# EAGLE design ramanSpectrometer_electronic_controlBoard_5050 (EAGLE 6.2)
meridianScientific DIY 3dPrintable_raspberryPi_ramanSpectrometer controlBoard_01_rev-01
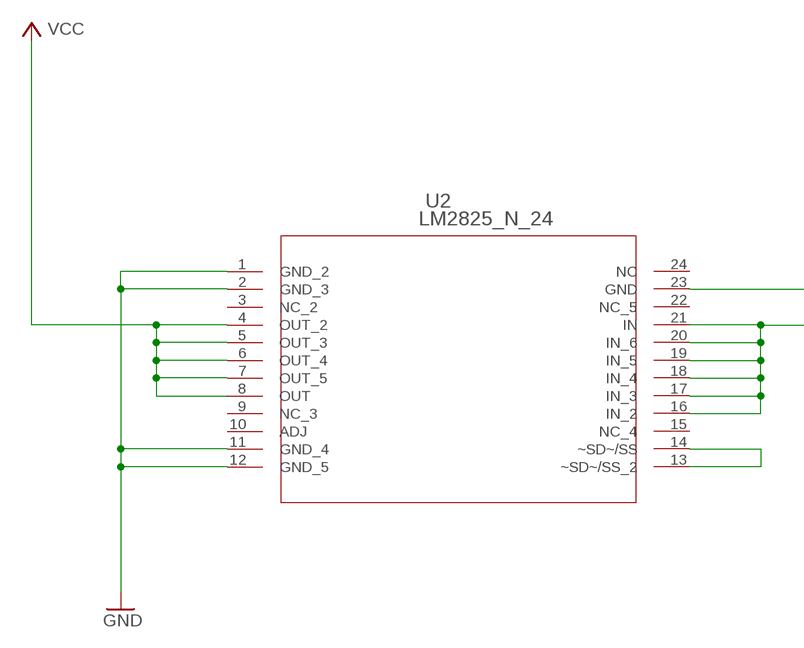
[diagram p0: schematic, sheet 1, part 1 of 2]
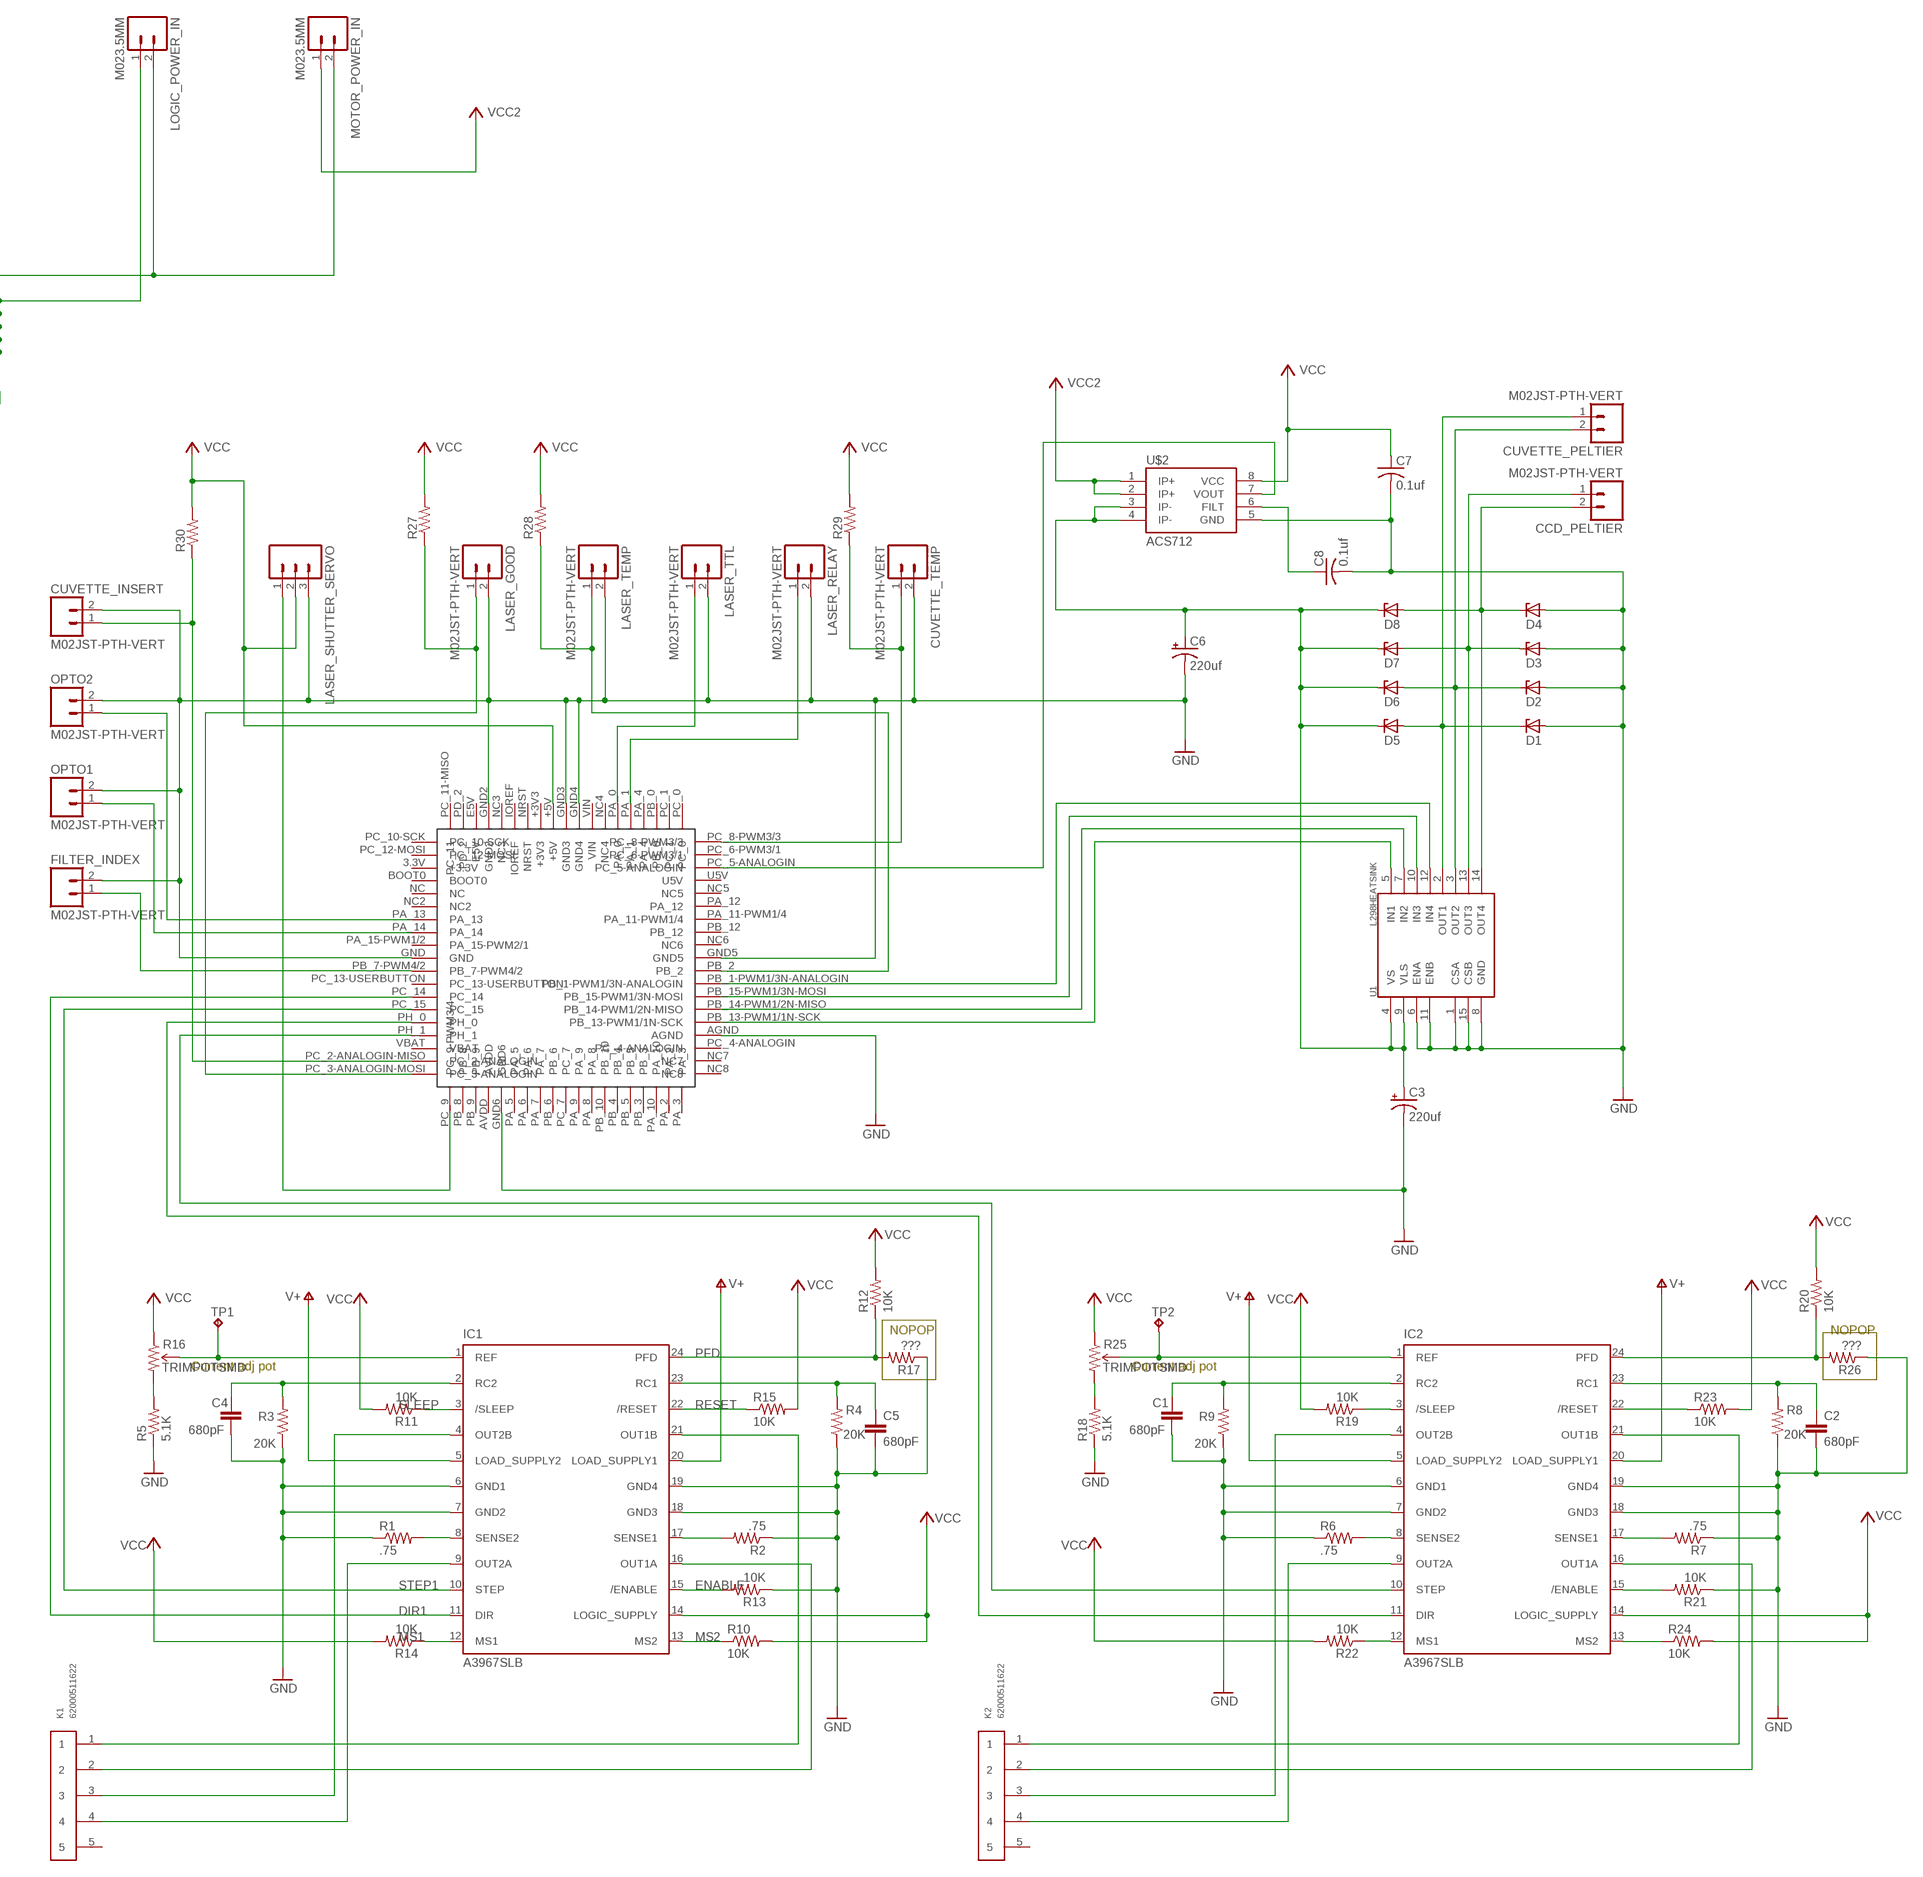
[diagram p1: schematic, sheet 1, part 2 of 2]

## Parts
C1  680pF  CAP0402  [C0402]
C2  680pF  CAP0402  [C0402]
C3  220uf  CAP_POLD  [PANASONIC_D]
C4  680pF  CAP0402  [C0402]
C5  680pF  CAP0402  [C0402]
C6  220uf  CAP_POLD  [PANASONIC_D]
C7  0.1uf  C-USC1206  [C1206]
C8  0.1uf  C-USC1206  [C1206]
CCD_PELTIER  M02JST-PTH-VERT  [JST-2-PTH-VERT]
CUVETTE_INSERT  M02JST-PTH-VERT  [JST-2-PTH-VERT]
CUVETTE_PELTIER  M02JST-PTH-VERT  [JST-2-PTH-VERT]
CUVETTE_TEMP  M02JST-PTH-VERT  [JST-2-PTH-VERT]
D1  ZENER-DIODESMB  [SMB]
D2  ZENER-DIODESMB  [SMB]
D3  ZENER-DIODESMB  [SMB]
D4  ZENER-DIODESMB  [SMB]
D5  ZENER-DIODESMB  [SMB]
D6  ZENER-DIODESMB  [SMB]
D7  ZENER-DIODESMB  [SMB]
D8  ZENER-DIODESMB  [SMB]
FILTER_INDEX  M02JST-PTH-VERT  [JST-2-PTH-VERT]
IC1  A3967SLB  [SO24W]
IC2  A3967SLB  [SO24W]
K1  62000511622  [62000511622]
K2  62000511622  [62000511622]
LASER_GOOD  M02JST-PTH-VERT  [JST-2-PTH-VERT]
LASER_RELAY  M02JST-PTH-VERT  [JST-2-PTH-VERT]
LASER_SHUTTER_SERVO  M03PTH  [1X03]
LASER_TEMP  M02JST-PTH-VERT  [JST-2-PTH-VERT]
LASER_TTL  M02JST-PTH-VERT  [JST-2-PTH-VERT]
LOGIC_POWER_IN  M023.5MM  [SCREWTERMINAL-3.5MM-2]
MOTOR_POWER_IN  M023.5MM  [SCREWTERMINAL-3.5MM-2]
OPTO1  M02JST-PTH-VERT  [JST-2-PTH-VERT]
OPTO2  M02JST-PTH-VERT  [JST-2-PTH-VERT]
R1  .75  R-US_R0805  [R0805]
R2  .75  R-US_R0805  [R0805]
R3  20K  RESISTOR0402  [C0402]
R4  20K  RESISTOR0402  [C0402]
R5  5.1K  RESISTOR0402  [C0402]
R6  .75  R-US_R0805  [R0805]
R7  .75  R-US_R0805  [R0805]
R8  20K  RESISTOR0402  [C0402]
R9  20K  RESISTOR0402  [C0402]
R10  10K  RESISTOR0402  [C0402]
R11  10K  RESISTOR0402  [C0402]
R12  10K  RESISTOR0402  [C0402]
R13  10K  RESISTOR0402  [C0402]
R14  10K  RESISTOR0402  [C0402]
R15  10K  RESISTOR0402  [C0402]
R16  TRIMPOTSMD  [TRIMPOT-3MM]
R17  ???  RESISTOR0402  [C0402]
R18  5.1K  RESISTOR0402  [C0402]
R19  10K  RESISTOR0402  [C0402]
R20  10K  RESISTOR0402  [C0402]
R21  10K  RESISTOR0402  [C0402]
R22  10K  RESISTOR0402  [C0402]
R23  10K  RESISTOR0402  [C0402]
R24  10K  RESISTOR0402  [C0402]
R25  TRIMPOTSMD  [TRIMPOT-3MM]
R26  ???  RESISTOR0402  [C0402]
R27  R-US_M1206  [M1206]
R28  R-US_M1206  [M1206]
R29  R-US_M1206  [M1206]
R30  R-US_M1206  [M1206]
TP1  TPPAD1-13  [P1-13]
TP2  TPPAD1-13  [P1-13]
U1  L298HEATSINK  [MULTIWATT15_6400BGHEATSINK]
U2  LM2825_N_24  [NA24F]
U$1  STNUCLEOF401RE  [F401-RE]
U$2  ACS712  [SO08]

## Nets
+5V: C7.1 IC1.14(LOGIC_SUPPLY) IC2.14(LOGIC_SUPPLY) LASER_SHUTTER_SERVO.2 MOTOR_POWER_IN.1 R10.2 R11.2 R19.2 R20.2 R22.2 R23.2 R24.2 R25.1(CCW) R27.2 R28.2 R29.2 R30.2 U2.4(OUT_2) U2.5(OUT_3) U2.6(OUT_4) U2.7(OUT_5) U2.8(OUT) U$1.+5V U$2.8(VCC) ; supply symbol labelled VCC, VCC2
DIR1: IC1.11(DIR) U$1.PC_14
DIR2: IC2.11(DIR) U$1.PH_0
ENABLE: IC1.15(/ENABLE) R13.2
GND: C1.2 C2.2 C3.- C4.2 C5.2 C6.- C7.2 C8.2 CUVETTE_INSERT.2 CUVETTE_TEMP.2 D1.A D2.A D3.A D4.A FILTER_INDEX.2 IC1.6(GND1) IC1.7(GND2) IC1.18(GND3) IC1.19(GND4) IC2.6(GND1) IC2.7(GND2) IC2.18(GND3) IC2.19(GND4) LASER_GOOD.2 LASER_RELAY.2 LASER_SHUTTER_SERVO.3 LASER_TEMP.2 LASER_TTL.2 OPTO1.2 OPTO2.2 R1.1 R2.1 R3.1 R4.1 R5.1 R6.1 R7.1 R8.1 R9.1 R13.1 R17.1 R18.1 R21.1 R26.1 U1.1(CSA) U1.6(ENA) U1.8(GND) U1.11(ENB) U1.15(CSB) U2.1(GND_2) U2.2(GND_3) U2.11(GND_4) U2.12(GND_5) U$1.AGND U$1.GND U$1.GND2 U$1.GND3 U$1.GND4 U$1.GND5 U$1.GND6 U$2.5(GND)
MS1: IC1.12(MS1) R14.1
MS2: IC1.13(MS2) R10.1
N$1: IC1.8(SENSE2) R1.2
N$2: IC2.24(PFD) R20.1 R26.2
N$3: IC1.17(SENSE1) R2.2
N$4: C2.1 IC2.23(RC1) R8.2
N$5: C4.1 IC1.2(RC2) R3.2
N$6: IC2.22(/RESET) R23.1
N$7: C5.1 IC1.23(RC1) R4.2
N$8: IC2.3(/SLEEP) R19.1
N$9: IC2.17(SENSE1) R7.2
N$10: R18.2 R25.3(CW)
N$11: R5.2 R16.3(CW)
N$12: IC1.1(REF) R16.2(WIPER) TP1.1(TP)
N$13: CUVETTE_PELTIER.1 D1.C D5.A U1.2(OUT1)
N$14: CUVETTE_PELTIER.2 D2.C D6.A U1.3(OUT2)
N$15: CCD_PELTIER.1 D3.C D7.A U1.13(OUT3)
N$16: CCD_PELTIER.2 D4.C D8.A U1.14(OUT4)
N$17: U1.5(IN1) U$1.PB_13-PWM1/1N-SCK
N$18: U1.7(IN2) U$1.PB_14-PWM1/2N-MISO
N$19: U1.10(IN3) U$1.PB_15-PWM1/3N-MOSI
N$20: U1.12(IN4) U$1.PB_1-PWM1/3N-ANALOGIN
N$21: C3.+ C6.+ D5.C D6.C D7.C D8.C U1.4(VS) U1.9(VLS) U$2.3(IP-) U$2.4(IP-)
N$22: U$2.1(IP+) U$2.2(IP+) ; supply symbol labelled VCC2
N$23: C8.1 U$2.6(FILT)
N$24: U$1.PC_5-ANALOGIN U$2.7(VOUT)
N$25: CUVETTE_TEMP.1 R29.1 U$1.PC_8-PWM3/3
N$26: LASER_RELAY.1 U$1.PA_1
N$27: LASER_TTL.1 U$1.PA_0
N$28: LASER_TEMP.1 R28.1 U$1.PB_2
N$29: LASER_GOOD.1 R27.1 U$1.PC_3-ANALOGIN-MOSI(PC_3-ANALOGIN)
N$30: CUVETTE_INSERT.1 R30.1 U$1.PC_2-ANALOGIN-MISO(PC_2-ANALOGIN)
N$31: OPTO2.1 U$1.PA_13
N$32: OPTO1.1 U$1.PA_14
N$33: LOGIC_POWER_IN.2 MOTOR_POWER_IN.2 U2.23(GND)
N$34: IC2.15(/ENABLE) R21.2
N$35: LASER_SHUTTER_SERVO.1 U$1.PC_9(PC_9-PWM3/4)
N$36: U2.13(~SD~/SS_2) U2.14(~SD~/SS)
N$37: LOGIC_POWER_IN.1 U2.16(IN_2) U2.17(IN_3) U2.18(IN_4) U2.19(IN_5) U2.20(IN_6) U2.21(IN)
N$38: IC2.13(MS2) R24.1
N$39: IC2.1(REF) R25.2(WIPER) TP2.1(TP)
N$40: IC2.12(MS1) R22.1
N$41: IC2.8(SENSE2) R6.2
N$42: C1.1 IC2.2(RC2) R9.2
N$43: IC2.9(OUT2A) K2.4
N$44: IC2.4(OUT2B) K2.3
N$45: IC1.4(OUT2B) K1.3
N$46: IC1.9(OUT2A) K1.4
N$47: IC1.16(OUT1A) K1.2
N$48: IC1.21(OUT1B) K1.1
N$49: FILTER_INDEX.1 U$1.PB_7-PWM4/2
OUT1A: IC2.16(OUT1A) K2.2
OUT1B: IC2.21(OUT1B) K2.1
PFD: IC1.24(PFD) R12.1 R17.2
RESET: IC1.22(/RESET) R15.1
SLEEP: IC1.3(/SLEEP) R11.1
STEP1: IC1.10(STEP) U$1.PC_15
STEP2: IC2.10(STEP) U$1.PH_1
V+: IC1.5(LOAD_SUPPLY2) IC1.20(LOAD_SUPPLY1) IC2.5(LOAD_SUPPLY2) IC2.20(LOAD_SUPPLY1)
VCC: R12.2 R14.2 R15.2 R16.1(CCW)
Unconnected: K1.5 K2.5 U2.3(NC_2) U2.9(NC_3) U2.10(ADJ) U2.15(NC_4) U2.22(NC_5) U2.24(NC) U$1.+3V3 U$1.BOOT0 U$1.IOREF U$1.NC U$1.NC2 U$1.NC3 U$1.NC4 U$1.NC5 U$1.NC7 U$1.NC8 U$1.NRST U$1.PA_2 U$1.PA_3 U$1.PA_4 U$1.PA_5 U$1.PA_6 U$1.PA_7 U$1.PA_8 U$1.PA_9 U$1.PA_10 U$1.PA_11-PWM1/4 U$1.PA_12 U$1.PA_15-PWM1/2(PA_15-PWM2/1) U$1.PB_0 U$1.PB_3 U$1.PB_4 U$1.PB_5 U$1.PB_6 U$1.PB_8 U$1.PB_9 U$1.PB_10 U$1.PB_12 U$1.PC_0 U$1.PC_1 U$1.PC_4-ANALOGIN U$1.PC_6-PWM3/1 U$1.PC_7 U$1.PC_10-SCK U$1.PC_11-MISO(PC_11) U$1.PC_12-MOSI U$1.PC_13-USERBUTTON U$1.PD_2 U$1.U5V U$1.VIN

## Notes on the sheet
- NOPOP | NOPOP
- Current adj pot | Current adj pot

## Power pins joined to a net without a drawn wire
+3.3V: U$1.3.3V(+3.3V)
AVDD: U$1.AVDD
E5V: U$1.E5V
NC6: U$1.NC6
VBAT: U$1.VBAT

## Library data of the parts
C1 C2 C4 C5 = SparkFun03_30_09:CAP: Capacitor Standard 0603 ceramic capacitor, and 0.1" leaded capacitor.
C3 C6 = SparkFun-Capacitors:CAP_POL: Capacitor Polarized These are standard SMD and PTH capacitors. Normally 10uF, 47uF, and 100uF in electrolytic and tantalum varieties. Always verify the external diameter of the through hole cap, it varies with capacity, voltage, and manufacturer. The EIA devices should be standard.
C7 C8 = adafruit:C-US: CAPACITOR, American symbol
CCD_PELTIER CUVETTE_INSERT CUVETTE_PELTIER CUVETTE_TEMP FILTER_INDEX LASER_GOOD LASER_RELAY LASER_TEMP LASER_TTL LOGIC_POWER_IN MOTOR_POWER_IN OPTO1 OPTO2 = SparkFun-Connectors:M02: Standard 2-pin 0.1" header. Use with - straight break away headers ( PRT-00116) - right angle break away headers (PRT-00553) - swiss pins (PRT-00743) - machine pins (PRT-00117) - female headers (PRT-00115) Molex polarized connector foot print use with: PRT-08233 with associated crimp pins and housings. 2.54_SCREWTERM for use with PRT-10571. 3.5mm Screw Terminal footprints for PRT-08084 5mm Screw Terminal footprints for use with PRT-08433
D1-D8 = diode:ZENER-DIODE: Z-Diode
IC1 IC2 = Allegro:A3967SLB: ANALOG DEVICES
K1 K2 = Wuerth_Elektronik_eiCan_Wire_to_Board_Connectors:62000511622: WR-WTB 2.00mm Male Vertical Shrouded Header, 5 Pins
LASER_SHUTTER_SERVO = SparkFun-Connectors:M03: Header 3 Standard 3-pin 0.1" header. Use with straight break away headers (SKU : PRT-00116), right angle break away headers (PRT-00553), swiss pins (PRT-00743), machine pins (PRT-00117), and female headers (PRT-00115). Molex polarized connector foot print use with SKU : PRT-08232 with associated crimp pins and housings.
R1 R2 R6 R7 = rcl:R-US_: RESISTOR, American symbol
R3-R5 R8-R15 R17-R24 R26 = SparkFun03_30_09:RESISTOR: Resistor Basic schematic elements and footprints for 0603, 1206, and PTH 1/10th watt (small) resistors.
R16 R25 = SparkFun:TRIMPOT
R27-R30 = adafruit:R-US_: RESISTOR, American symbol
TP1 TP2 = testpad:TP
U1 = SparkFun-PowerIC:L298: L298 Dual Full Bridge Driver
U2 = lm2825:LM2825_N_24; BASE_PN: LM2825; COMPTYPE: Switcher; PARTNUMBER: LM2825HN-ADJ; SYMBOL: NameLM2825HN-ADJ; TYPE: LM2825HN-ADJ; VENDOR: NationalSemiconductor; VERSION: 05/02/2007
U$1 = nucleoF401RE:STNUCLEOF401RE
U$2 = SparkFun-AnalogIC:ACS712: Hall-effect-based isolated linear current sensor

## Board
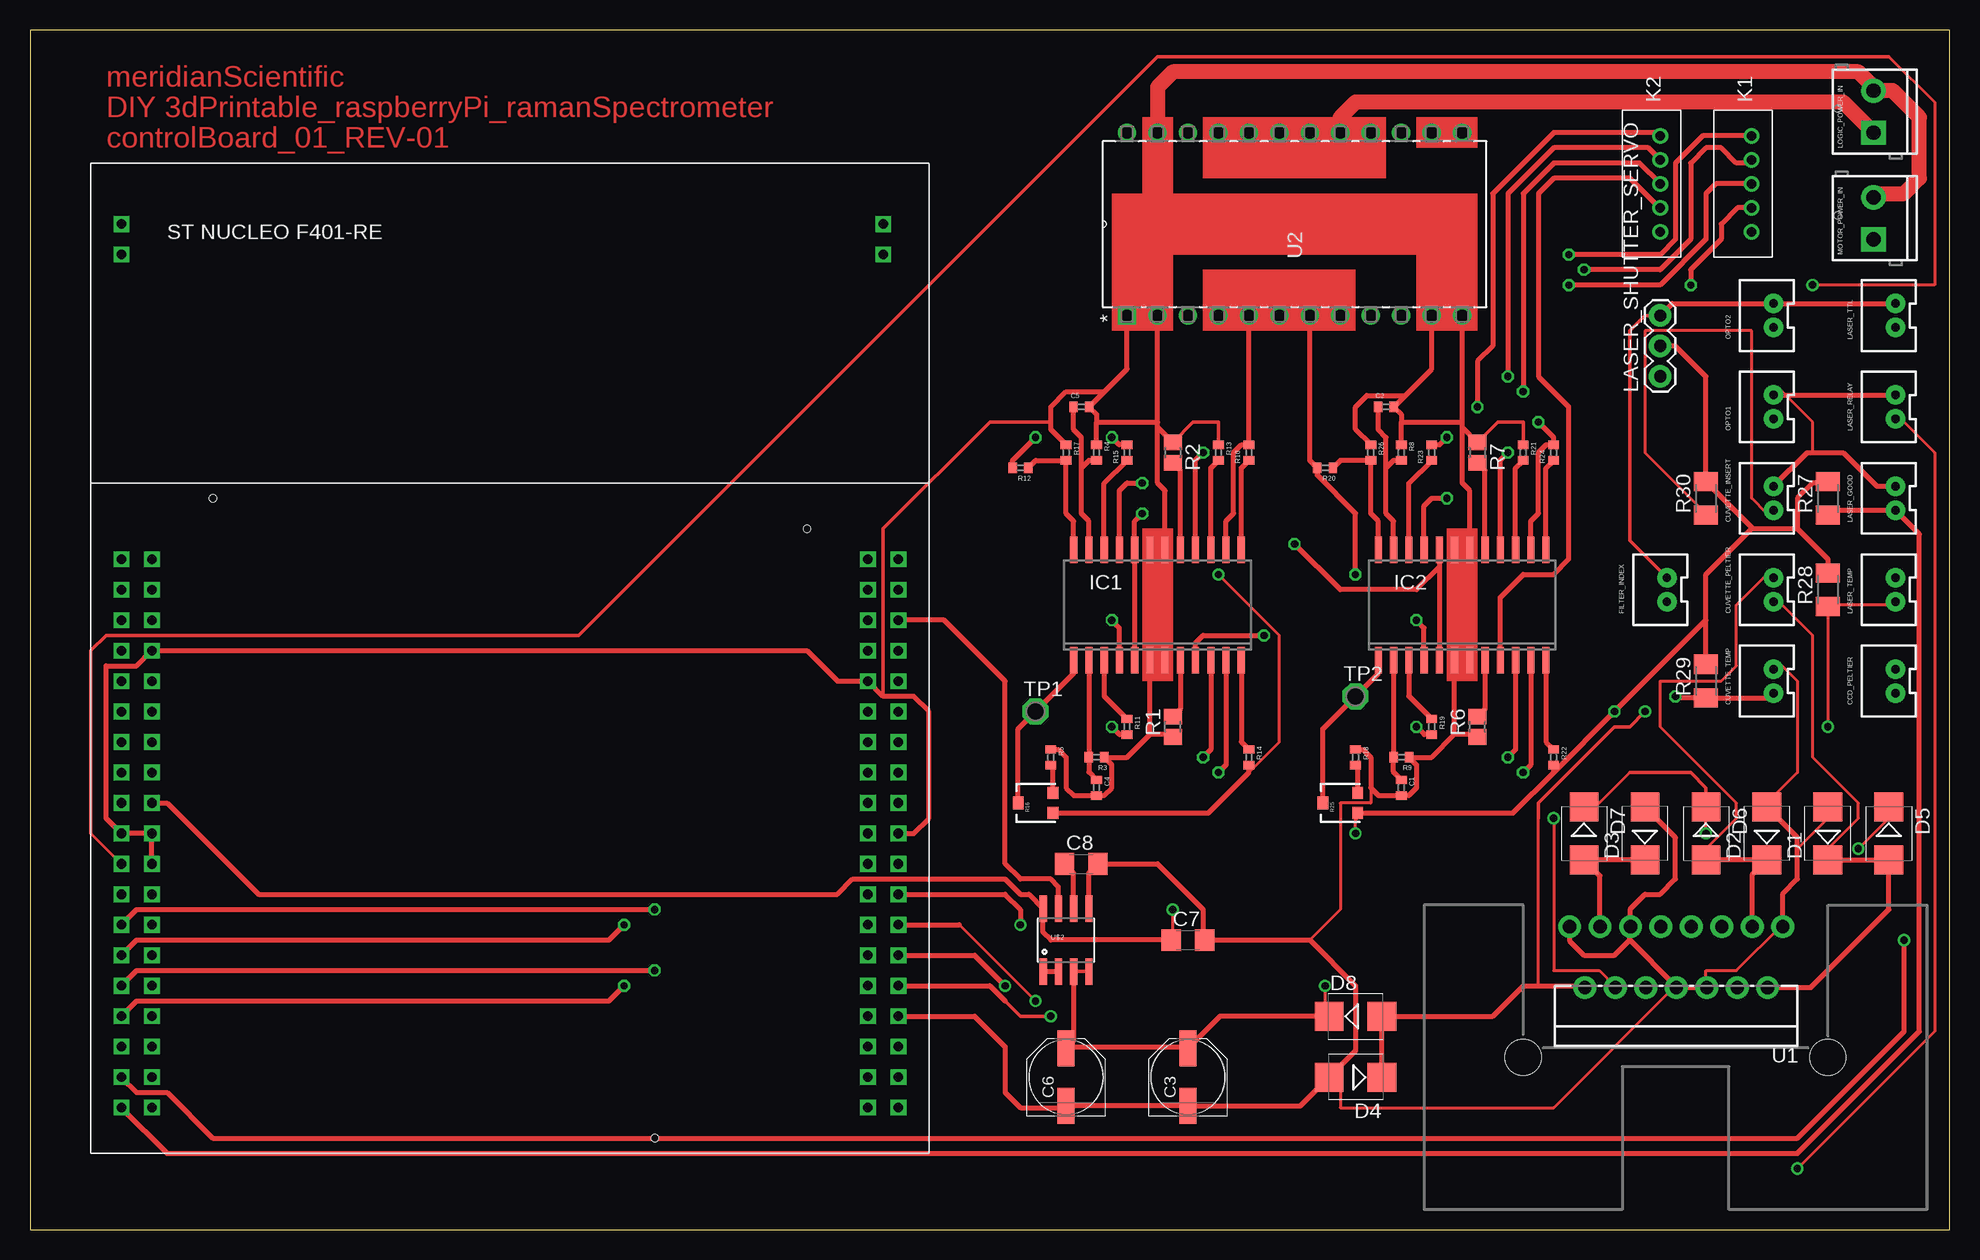
[diagram p2: board, top side]
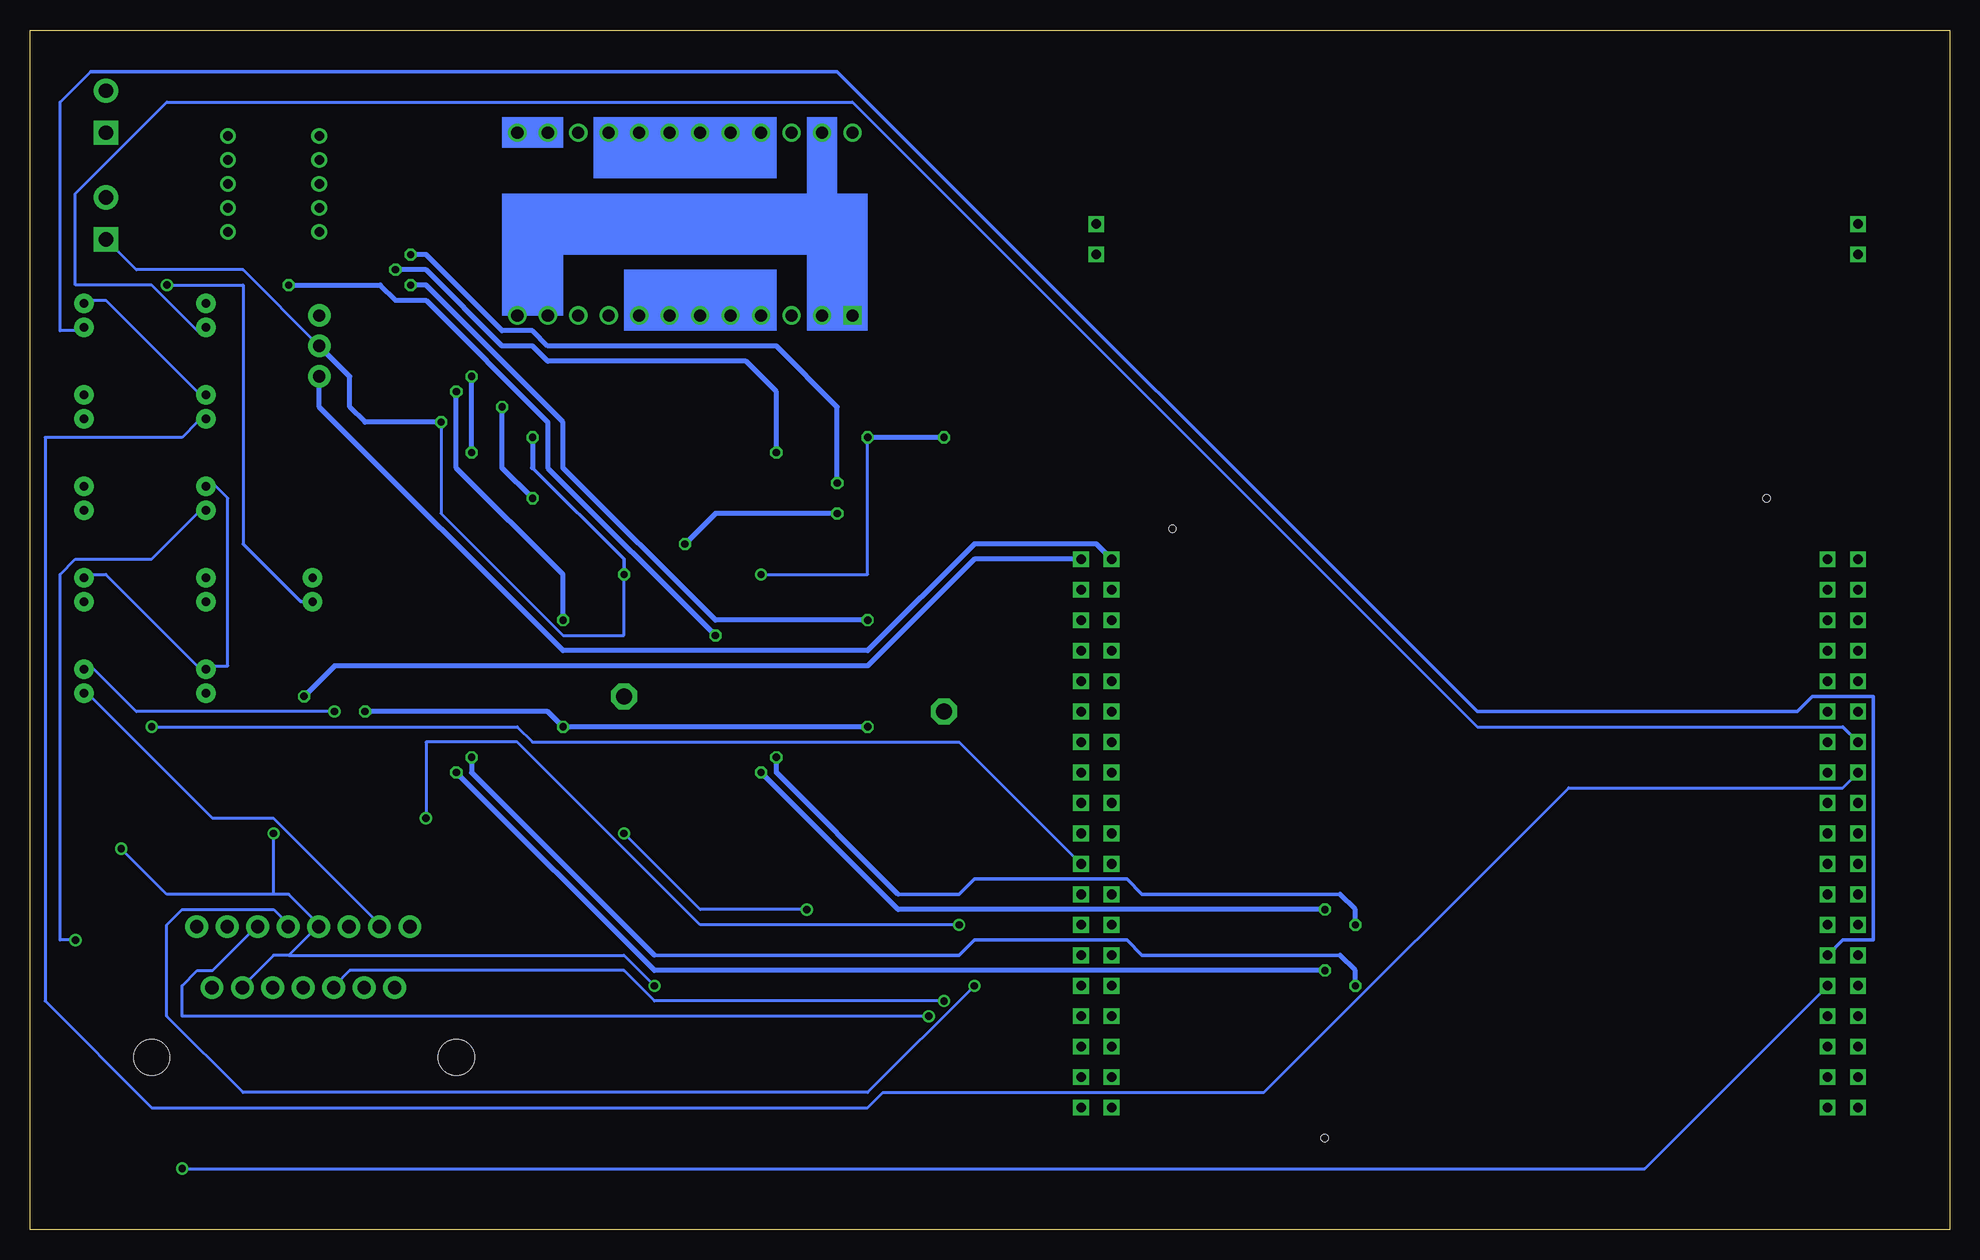
[diagram p3: board, bottom side, seen from below]

Size 160 x 100 mm. Coordinates in mm from the lower left corner, seen from the top.
Outline: 0,0 160,0 160,100 0,100 0,0
Copper layers (1*16): Top 0.035mm / dielectric 1.5mm / Bottom 0.035mm
Design rules: minimum track width 10mil, minimum drill 24mil, track to track 8mil, track to pad 8mil, pad to pad 8mil, via to via 8mil, smd to smd 8mil, copper to edge 40mil, drill to drill 8mil, minimum pad ring 10mil, minimum via ring 8mil, stop-mask expansion 4mil, vias tented up to drill 0mil, thermal gap 10mil

### Footprints (pad centres in the part's own frame; a part is rotated, then mirrored left to right if it is on the bottom)
C0402 = smd 0.7 x 0.9: 1 -0.65,0; 2 0.65,0
PANASONIC_D = smd 3 x 1.4: + 2.4,0; - -2.4,0
C1206 = smd 1.6 x 1.8: 1 -1.4,0; 2 1.4,0
JST-2-PTH-VERT = drill 0.7 pad 1.626: 1 -1,-0.55; 2 1,-0.55
SMB = smd 2.4 x 2.4: A 2.2,0; C -2.2,0
SO24W = smd 0.6 x 2.2: 1 -6.985,-4.6; 2 -5.715,-4.6; 3 -4.445,-4.6; 4 -3.175,-4.6; 5 -1.905,-4.6; 6 -0.635,-4.6; 7 0.635,-4.6; 8 1.905,-4.6; 9 3.175,-4.6; 10 4.445,-4.6; 11 5.715,-4.6; 12 6.985,-4.6; 13 6.985,4.6; 14 5.715,4.6; 15 4.445,4.6; 16 3.175,4.6; 17 1.905,4.6; 18 0.635,4.6; 19 -0.635,4.6; 20 -1.905,4.6; 21 -3.175,4.6; 22 -4.445,4.6; 23 -5.715,4.6; 24 -6.985,4.6
62000511622 = drill 0.8: 1 1,0; 2 -1,0; 3 -3,0; 4 -5,0; 5 -7,0
1X03 = drill 1.016 pad 1.88: 1 0,0; 2 2.54,0; 3 5.08,0
SCREWTERMINAL-3.5MM-2 = drill 1.2 pad 2.032 square: 1 0,0 | drill 1.2 pad 2.032: 2 3.5,0
R0805 = smd 1.3 x 1.5: 1 -0.85,0; 2 0.85,0
TRIMPOT-3MM = smd 1 x 0.9: 1 -0.85,-1.45; 3 0.85,-1.45 | smd 1.1 x 0.9: 2 0,1.45
M1206 = smd 1.6 x 2: 1 -1.4,0; 2 1.4,0
P1-13 = drill 1.321 pad 2.159 octagon: 1 0,0
MULTIWATT15_6400BGHEATSINK = drill 1.1 pad 1.9: 1 -8.95,-2.39; 2 -7.68,2.69; 3 -6.41,-2.39; 4 -5.14,2.69; 5 -3.87,-2.39; 6 -2.6,2.69; 7 -1.33,-2.39; 8 -0.06,2.69; 9 1.21,-2.39; 10 2.48,2.69; 11 3.75,-2.39; 12 5.02,2.69; 13 6.29,-2.39; 14 7.56,2.69; 15 8.83,-2.39 | hole 2.997: -12.7,8.509; 12.7,8.509
NA24F = drill 1.016 square: 1 -15.24,27.94 | drill 1.016: 2 -15.24,25.4; 3 -15.24,22.86; 4 -15.24,20.32; 5 -15.24,17.78; 6 -15.24,15.24; 7 -15.24,12.7; 8 -15.24,10.16; 9 -15.24,7.62; 10 -15.24,5.08; 11 -15.24,2.54; 12 -15.24,0; 13 0,0; 14 0,2.54; 15 0,5.08; 16 0,7.62; 17 0,10.16; 18 0,12.7; 19 0,15.24; 20 0,17.78; 21 0,20.32; 22 0,22.86; 23 0,25.4; 24 0,27.94
F401-RE = drill 0.8 square: 3.3V 2.54,44.45; +3V3 5.08,31.75; +5V 5.08,29.21; AGND 67.31,11.43; AVDD 64.77,41.91; BOOT0 2.54,41.91; E5V 5.08,44.45; GND 2.54,26.67; GND2 5.08,41.91; GND3 5.08,26.67; GND4 5.08,24.13; GND5 64.77,39.37; GND6 67.31,26.67; IOREF 5.08,36.83; NC 2.54,39.37; NC2 2.54,36.83; NC3 5.08,39.37; NC4 5.08,19.05; NC5 67.31,39.37; NC6 67.31,29.21; NC7 67.31,6.35; NC8 67.31,3.81; NRST 5.08,34.29; P$1 66.04,77.47; P$2 66.04,74.93; P$3 2.54,77.47; P$4 2.54,74.93; PA_0 5.08,16.51; PA_1 5.08,13.97; PA_2 64.77,6.35; PA_3 64.77,3.81; PA_4 5.08,11.43; PA_5 64.77,36.83; PA_6 64.77,34.29; PA_7 64.77,31.75; PA_8 64.77,21.59; PA_9 64.77,24.13; PA_10 64.77,8.89; PA_11-PWM1/4 67.31,34.29; PA_12 67.31,36.83; PA_13 2.54,34.29; PA_14 2.54,31.75; PA_15-PWM1/2 2.54,29.21; PB_0 5.08,8.89; PB_1-PWM1/3N-ANALOGIN 67.31,21.59; PB_2 67.31,24.13; PB_3 64.77,11.43; PB_4 64.77,16.51; PB_5 64.77,13.97; PB_6 64.77,29.21; PB_7-PWM4/2 2.54,24.13; PB_8 64.77,46.99; PB_9 64.77,44.45; PB_10 64.77,19.05; PB_12 67.31,31.75; PB_13-PWM1/1N-SCK 67.31,13.97; PB_14-PWM1/2N-MISO 67.31,16.51; PB_15-PWM1/3N-MOSI 67.31,19.05; PC_0 5.08,3.81; PC_1 5.08,6.35; PC_2-ANALOGIN-MISO 2.54,6.35; PC_3-ANALOGIN-MOSI 2.54,3.81; PC_4-ANALOGIN 67.31,8.89; PC_5-ANALOGIN 67.31,44.45; PC_6-PWM3/1 67.31,46.99; PC_7 64.77,26.67; PC_8-PWM3/3 67.31,49.53; PC_9 64.77,49.53; PC_10-SCK 2.54,49.53; PC_11-MISO 5.08,49.53; PC_12-MOSI 2.54,46.99; PC_13-USERBUTTON 2.54,21.59; PC_14 2.54,19.05; PC_15 2.54,16.51; PD_2 5.08,46.99; PH_0 2.54,13.97; PH_1 2.54,11.43; U5V 67.31,41.91; VBAT 2.54,8.89; VIN 5.08,21.59 | hole 0.6: 46.99,1.27; 10.16,54.61; 59.69,52.07
SO08 = smd 0.61 x 2.21: 1 -1.905,-2.616; 2 -0.635,-2.616; 3 0.635,-2.616; 4 1.905,-2.616; 5 1.905,2.616; 6 0.635,2.616; 7 -0.635,2.616; 8 -1.905,2.616

### Placement (x,y rotation side)
C1  114.3,36.83 270 top
C2  113.03,68.58 0 top
C3  96.52,12.7 90 top
C4  88.9,36.83 270 top
C5  87.63,68.58 0 top
C6  86.36,12.7 90 top
C7  96.52,24.13 0 top
C8  87.63,30.48 0 top
CCD_PELTIER  154.94,45.72 90 top
CUVETTE_INSERT  144.78,60.96 90 top
CUVETTE_PELTIER  144.78,53.34 90 top
CUVETTE_TEMP  144.78,45.72 90 top
D1  149.86,33.02 90 top
D2  144.78,33.02 90 top
D3  134.62,33.02 90 top
D4  110.49,12.7 180 top
D5  154.94,33.02 270 top
D6  139.7,33.02 270 top
D7  129.54,33.02 270 top
D8  110.49,17.78 0 top
FILTER_INDEX  135.89,53.34 90 top
IC1  93.98,52.07 0 top
IC2  119.38,52.07 0 top
K1  143.51,90.17 90 top
K2  135.89,90.17 90 top
LASER_GOOD  154.94,60.96 90 top
LASER_RELAY  154.94,68.58 90 top
LASER_SHUTTER_SERVO  135.89,71.12 90 top
LASER_TEMP  154.94,53.34 90 top
LASER_TTL  154.94,76.2 90 top
LOGIC_POWER_IN  153.67,91.44 90 top
MOTOR_POWER_IN  153.67,82.55 90 top
OPTO1  144.78,68.58 90 top
OPTO2  144.78,76.2 90 top
R1  95.25,41.91 90 top
R2  95.25,64.77 270 top
R3  88.9,39.37 180 top
R4  88.9,64.77 270 top
R5  85.09,39.37 270 top
R6  120.65,41.91 90 top
R7  120.65,64.77 270 top
R8  114.3,64.77 270 top
R9  114.3,39.37 180 top
R10  101.6,64.77 90 top
R11  91.44,41.91 270 top
R12  82.55,63.5 180 top
R13  99.06,64.77 270 top
R14  101.6,39.37 270 top
R15  91.44,64.77 90 top
R16  83.82,35.56 90 top
R17  86.36,64.77 270 top
R18  110.49,39.37 270 top
R19  116.84,41.91 270 top
R20  107.95,63.5 180 top
R21  124.46,64.77 270 top
R22  127,39.37 270 top
R23  116.84,64.77 90 top
R24  127,64.77 90 top
R25  109.22,35.56 90 top
R26  111.76,64.77 270 top
R27  149.86,60.96 90 top
R28  149.86,53.34 90 top
R29  139.7,45.72 90 top
R30  139.7,60.96 90 top
TP1  83.82,43.18 0 top
TP2  110.49,44.45 0 top
U1  137.16,22.86 180 top
U2  119.38,91.44 90 top
U$1  5.08,6.35 0 top
U$2  86.36,24.13 0 top

### Tracks (layer width: path | path; a pad name or v marks a point on that pad's centre or on a via)
+5V  (via drill 0.6, 0.61)
  Top 0.254: v110.49,33.02 110.49,34.29 R25.1 | v95.25,26.67 95.25,24.13 C7.1
  Top 0.406: U2.8 U2.7 | U2.7 U2.6 U2.5 | U2.5 U2.4 | 127,38.1 123.61,34.71 R25.1 110.67,34.47 110.49,34.29 | 127,38.1 R22.2 | IC2.14 125.09,59.05 125.73,59.69 125.73,64.77 126.38,65.42 R24.2 127,66.04 v125.73,67.31 | IC1.14 99.69,59.05 100.33,59.69 100.33,64.77 100.98,65.42 R10.2 U2.5 | U2.7 106.68,64.12 R20.2 107.3,62.88 110.49,59.69 v110.49,54.61 | R27.2 149.73,62.23 148.59,62.23 147.32,60.96 147.32,58.42 | 147.32,58.42 149.86,55.88 R28.2 | 143.57,58.48 R30.2 139.7,71.12 137.16,73.66 LASER_SHUTTER_SERVO.2 | 143.57,58.48 143.64,58.42 147.32,58.42 | C7.1 85.09,24.13 84.45,24.77 U$2.8 83.26,27.94 82.55,27.94 81.28,29.21 68.58,29.21 67.31,27.94 19.05,27.94 11.43,35.56 U$1.+5V | R29.2 139.7,50.8 | 139.7,50.8 139.7,54.61 143.57,58.48 | R23.2 117.49,65.42 v118.11,66.04 | R19.2 116.22,41.26 v115.57,41.91 | R11.2 90.82,41.26 v90.17,41.91 | 139.7,50.8 v132.08,43.18 127,38.1
  Bottom 0.254: MOTOR_POWER_IN.1 151.13,80.01 142.24,80.01 LASER_SHUTTER_SERVO.2 | v110.49,54.61 110.49,49.53 115.57,49.53 125.73,59.69 v125.73,67.31 | v110.49,33.02 104.14,26.67 v95.25,26.67
  Bottom 0.305: 118.11,63.5 110.49,55.88 v110.49,54.61
  Bottom 0.406: v125.73,67.31 132.08,67.31 133.35,68.58 133.35,71.12 LASER_SHUTTER_SERVO.2 | v118.11,66.04 118.11,63.5 | v90.17,41.91 v115.57,41.91 116.84,43.18 v132.08,43.18
DIR1  (via drill 0.6)
  Top 0.406: IC1.11 99.69,38.73 v99.06,38.1 | U$1.PC_14 8.89,26.67 v52.07,26.67
  Bottom 0.406: v52.07,26.67 87.63,26.67 v99.06,38.1
DIR2  (via drill 0.6)
  Top 0.406: IC2.11 125.09,38.73 v124.46,38.1 | U$1.PH_0 8.89,21.59 v52.07,21.59
  Bottom 0.406: v52.07,21.59 107.95,21.59 v124.46,38.1
ENABLE
  Top 0.406: IC1.15 98.42,63.48 R13.2
GND
  Top 0.254: 147.32,31.75 149.86,34.29 D1.A | U1.1 146.05,25.4 142.24,21.59 139.7,21.59 139.7,20.32 U1.6 | 148.59,64.77 148.59,67.31 146.05,69.85 OPTO1.2 | D2.A 144.78,35.56 147.32,38.1 147.32,45.72 146.05,46.99 CUVETTE_TEMP.2 | 106.68,24.13 109.22,26.67 109.22,35.56 111.76,35.56 111.76,36.83 | U1.8 137.16,20.32 127,10.16 109.22,10.16 109.22,12.7 D4.A
  Top 0.305: R7.1 122.34,67.31 124.46,67.31 R21.1 | R2.1 96.94,67.31 99.06,67.31 R13.1 | FILTER_INDEX.2 133.35,57.43 133.35,74.93 134.62,76.2 LASER_SHUTTER_SERVO.3 | 71.12,44.45 71.12,58.42 80.01,67.31 85.09,67.31
  Top 0.406: U2.2 U2.1 91.44,71.74 89.55,69.85 | U2.11 U2.12 119.38,67.31 | U2.11 116.84,83.82 93.98,83.82 U2.2 | 88.9,67.31 88.9,67.96 C5.2 89.55,69.85 | IC1.18 IC1.19 | IC1.18 IC1.7 IC1.6 93.34,41.27 | IC2.18 IC2.7 IC2.6 118.75,41.27 | IC2.19 IC2.18 | R8.1 114.3,67.31 | 93.34,41.27 91.44,39.37 R3.1 90.17,38.75 90.17,36.83 89.52,36.18 C4.2 87.01,36.18 86.36,36.83 86.36,39.37 85.71,40.02 R5.1 | 118.75,41.27 116.84,39.37 R9.1 115.57,38.75 115.57,36.83 114.92,36.18 C1.2 112.41,36.18 111.76,36.83 111.76,39.37 111.11,40.02 R18.1 | R1.1 95.03,41.27 93.34,41.27 | R6.1 120.44,41.27 118.75,41.27 | 114.62,69.53 C2.2 114.3,67.96 114.3,67.31 | 114.62,69.53 116.84,71.74 U2.11 | R7.1 119.38,66.89 | 119.38,66.89 119.38,67.31 | R2.1 93.98,66.89 | 93.98,66.89 93.98,67.31 | 93.98,67.31 U2.2 | LASER_TTL.2 OPTO2.2 136.89,77.2 LASER_SHUTTER_SERVO.3 | OPTO1.2 LASER_RELAY.2 | CUVETTE_INSERT.2 148.14,64.77 148.59,64.77 151.13,64.77 153.94,61.96 LASER_GOOD.2 | IC2.18 120.02,61.59 119.38,62.23 119.38,66.89 | IC1.18 94.61,61.59 93.98,62.23 93.98,66.89 | 114.3,67.31 119.38,67.31 | R26.1 110.49,66.69 110.49,68.58 111.44,69.53 114.62,69.53 | R4.1 88.9,67.31 | 88.9,67.31 93.98,67.31 | R17.1 85.09,66.69 85.09,67.31 85.09,68.58 86.36,69.85 89.55,69.85 | D3.A 137.16,32.68 137.16,29.21 135.89,27.94 134.62,27.94 133.41,26.73 U1.11 133.35,25.19 133.35,24.13 | U1.1 146.11,28 147.32,29.21 147.32,31.75 147.32,32.68 D2.A | U1.15 128.33,24.07 129.54,22.86 132.08,22.86 133.35,24.13 | U1.6 U1.8 137.22,20.26 137.16,20.32 133.35,24.13 | U$2.5 88.27,29.71 C8.2 93.98,30.48 97.79,26.67 97.79,24.26 C7.2 106.68,24.13 110.49,20.32 110.49,14.9 D4.A 105.89,10.3 C3.- C6.- 86.22,10.16 82.55,10.16 81.28,11.43 81.28,15.24 78.74,17.78 U$1.AGND
  Top 0.406: U$1.GND4 U$1.GND3 U$1.GND 6.35,34.29 6.35,46.99 8.89,46.99 U$1.GND2 64.77,48.26 67.31,45.72 U$1.GND5 71.12,44.45 73.66,44.45 74.93,43.18 74.93,34.29 73.66,33.02 U$1.GND6
  Bottom 0.254: OPTO1.2 146.05,69.85 153.67,77.47 154.94,77.47 LASER_TTL.2 | LASER_TEMP.2 154.94,54.61 153.67,54.61 146.05,46.99 CUVETTE_TEMP.2 144.78,46.99 143.51,46.99 143.51,60.96 144.78,62.23 CUVETTE_INSERT.2
MS1
  Top 0.406: IC1.12 100.97,40.66 R14.1
MS2
  Top 0.406: IC1.13 100.97,63.48 R10.1
N$1
  Top 0.406: IC1.8 95.89,43.4 R1.2
N$2
  Top 0.406: IC2.24 112.39,59.05 111.76,59.69 R26.2 109.22,64.12 R20.1
N$3
  Top 0.406: IC1.17 95.89,63.28 R2.2
N$4
  Top 0.406: IC2.23 113.67,59.05 113.03,59.69 113.03,63.5 | 113.03,63.5 113.03,66.04 112.38,66.69 C2.1 | R8.2 113.65,64.12 113.03,63.5
N$5
  Top 0.406: IC1.2 88.27,39.38 R3.2 88.25,38.13 C4.1
N$6
  Top 0.406: IC2.22 114.94,62.22 R23.1
N$7
  Top 0.406: IC1.23 88.27,59.05 87.63,59.69 87.63,63.5 | 87.63,63.5 87.63,66.04 86.98,66.69 C5.1 | R4.2 88.25,64.12 87.63,63.5
N$8
  Top 0.406: IC2.3 114.94,44.47 R19.1
N$9
  Top 0.406: IC2.17 121.28,63.28 R7.2
N$10
  Top 0.406: R25.3 110.67,38.54 R18.2
N$11
  Top 0.406: R16.3 85.27,38.54 R5.2
N$12
  Top 0.406: IC1.1 87,46.35 TP1.1 82.37,41.73 R16.2
N$13
  Top 0.254: CUVETTE_PELTIER.1 146.05,52.07 148.59,49.53 148.59,39.37 152.4,35.56 152.4,34.29 149.86,31.75 D1.C
  Top 0.406: U1.2 148.44,20.17 154.94,26.67 D5.A D1.C
N$14
  Top 0.254: CUVETTE_PELTIER.2 144.78,54.61 142.24,52.07 142.24,46.99 140.97,45.72 135.89,45.72 135.89,41.91 142.24,35.56 142.24,34.29 139.7,31.75 D6.A
  Top 0.406: U1.3 143.57,29.61 D2.C | D2.C D6.A | D2.C 144.78,30.48
N$15
  Top 0.406: U1.13 130.87,29.49 D7.A D3.C
  Bottom 0.254: CCD_PELTIER.1 154.94,44.45 144.78,34.29 139.7,34.29 130.81,25.4 U1.13
N$16  (via drill 0.61)
  Top 0.254: 125.73,20.32 125.73,34.29
  Top 0.305: 125.73,34.29 125.73,35.56 132.08,41.91 133.35,41.91 v134.62,43.18
  Top 0.406: D4.C D8.A 121.92,17.78 124.46,20.32 125.73,20.32 129.45,20.32 U1.14
  Bottom 0.254: v134.62,43.18 151.13,43.18 154.94,46.99 CCD_PELTIER.2
N$17  (via drill 0.61)
  Top 0.305: 81.28,19.05 82.55,17.78 v85.09,17.78
  Top 0.406: U$1.PB_13-PWM1/1N-SCK 80.01,20.32 81.28,19.05
  Bottom 0.254: v85.09,17.78 147.32,17.78 147.32,20.32 146.05,21.59 144.78,21.59 140.97,25.4 U1.5
N$18  (via drill 0.61)
  Top 0.406: U$1.PB_14-PWM1/2N-MISO 78.74,22.86 v81.28,20.32
  Bottom 0.254: v81.28,20.32 90.17,11.43 142.24,11.43 148.59,17.78 148.59,25.4 147.32,26.67 139.7,26.67 138.43,25.4 U1.7
N$19  (via drill 0.61)
  Top 0.254: 77.47,25.4 v83.82,19.05
  Top 0.406: U$1.PB_15-PWM1/3N-MOSI 77.47,25.4
  Bottom 0.254: v83.82,19.05 107.95,19.05 110.49,21.59 133.35,21.59 134.62,20.32 U1.10
N$20  (via drill 0.61)
  Top 0.254: v127,34.29 127,21.59 130.81,21.59 132.08,20.32 U1.12
  Top 0.406: U$1.PB_1-PWM1/3N-ANALOGIN 81.28,27.94 82.55,26.67 v82.55,25.4
  Bottom 0.254: v127,34.29 127,40.64 119.38,40.64 104.14,25.4 v82.55,25.4
N$21  (via drill 0.61)
  Top 0.254: 133.35,38.1 130.81,35.56 129.54,35.56 D7.C | v152.4,31.75 154.94,34.29 D5.C | v139.7,33.02 D6.C | v107.95,20.32 107.95,17.78
  Top 0.305: U$2.3 U$2.4 | 133.35,38.1 138.43,38.1 139.7,36.83 D6.C
  Top 0.406: U$2.3 87,15.73 | 87,15.73 C6.+ | D8.C 107.95,17.78 99.2,17.78 C3.+ 96.38,15.24 86.36,15.24 86.86,15.73 87,15.73
  Bottom 0.254: v152.4,31.75 148.59,27.94 139.7,27.94 | 139.7,27.94 138.43,27.94 135.89,25.4 | 138.43,22.86 139.7,22.86 142.24,20.32 U1.4 | 135.89,25.4 138.43,22.86 | 135.89,25.4 U1.9 | 139.7,27.94 v139.7,33.02 | v107.95,20.32 110.49,22.86 138.43,22.86
N$22
  Top 0.406: U$2.1 U$2.2
N$23
  Top 0.406: U$2.6 87,29.71 C8.1
N$24
  Top 0.406: U$2.7 85.72,28.57 85.09,29.21 82.55,29.21 81.28,30.48 81.28,45.72 76.2,50.8 U$1.PC_5-ANALOGIN
N$25  (via drill 0.6)
  Top 0.406: CUVETTE_TEMP.1 144.93,44.32 R29.1 137.29,44.32 v137.16,44.45
  Bottom 0.406: U$1.PC_8-PWM3/3 81.28,55.88 90.17,46.99 134.62,46.99 v137.16,44.45
N$26  (via drill 0.61)
  Top 0.254: v147.32,5.08 158.75,16.51 158.75,64.77 156.21,67.31 LASER_RELAY.1
  Bottom 0.254: U$1.PA_1 25.4,5.08 v147.32,5.08
N$27
  Bottom 0.254: 154.94,96.52 157.48,93.98 157.48,74.93 156.21,74.93 LASER_TTL.1
  Bottom 0.305: 154.94,96.52 92.71,96.52 39.37,43.18 12.7,43.18 11.43,44.45 6.35,44.45 6.35,24.13 8.89,24.13 U$1.PA_0
N$28  (via drill 0.61)
  Top 0.254: LASER_TEMP.1 154.94,52.07 149.86,52.07 R28.1 v149.86,41.91
  Bottom 0.254: U$1.PB_2 82.55,40.64 118.11,40.64 119.38,41.91 v149.86,41.91
N$29
  Top 0.406: R27.1 150.26,59.96 LASER_GOOD.1 157.48,57.97 157.48,16.51 147.32,6.35 11.43,6.35 U$1.PC_3-ANALOGIN-MOSI
N$30  (via drill 0.61)
  Top 0.254: R30.1 139.7,59.69 134.62,64.77 134.62,74.93 143.51,74.93 143.51,60.96 144.78,59.69 CUVETTE_INSERT.1
  Top 0.406: U$1.PC_2-ANALOGIN-MISO 8.89,11.43 11.43,11.43 15.24,7.62 147.32,7.62 156.21,16.51 v156.21,24.13
  Bottom 0.254: v156.21,24.13 157.48,24.13 157.48,54.61 156.21,55.88 149.86,55.88 146.05,59.69 CUVETTE_INSERT.1
N$31
  Bottom 0.254: 8.89,41.91 39.37,41.91 91.44,93.98 148.59,93.98 156.21,86.36 156.21,78.74 149.86,78.74 146.05,74.93 OPTO2.1
  Bottom 0.305: U$1.PA_13 8.89,41.91
N$32
  Bottom 0.254: U$1.PA_14 8.89,36.83 31.75,36.83 57.15,11.43 88.9,11.43 90.17,10.16 149.86,10.16 158.75,19.05 158.75,66.04 147.32,66.04 146.05,67.31 OPTO1.1
N$33
  Top 0.406: U2.23 93.98,83.82
  Top 1.27: U2.23 93.98,95.25 95.25,96.52 152.4,96.52 153.67,95.25 LOGIC_POWER_IN.2 155.25,94.94 157.48,92.71 157.48,87.63 156.21,86.36 153.98,86.36 MOTOR_POWER_IN.2
N$34
  Top 0.406: IC2.15 123.83,63.48 R21.2
N$35
  Bottom 0.406: U$1.PC_9 71.12,57.15 81.28,57.15 90.17,48.26 115.57,48.26 135.89,68.58 LASER_SHUTTER_SERVO.1
N$36
  Top 0.406: U2.14 U2.13
N$37
  Top 0.406: U2.21 U2.20 U2.19 U2.18 U2.17 U2.16
  Top 1.27: LOGIC_POWER_IN.1 151.13,93.98 110.49,93.98 109.22,92.71 U2.17
N$38
  Top 0.406: IC2.13 126.36,63.48 R24.1
N$39
  Top 0.406: IC2.1 112.39,46.35 TP2.1 107.77,41.73 R25.2
N$40
  Top 0.406: IC2.12 126.36,40.66 R22.1
N$41
  Top 0.406: IC2.8 121.28,43.4 R6.2
N$42
  Top 0.406: IC2.2 113.67,39.38 R9.2 113.65,38.13 C1.1
N$43
  Top 0.406: IC2.9 122.56,52.7 124.46,54.61 127,54.61 128.27,55.88 128.27,68.58 125.73,71.12 125.73,86.36 127,87.63 133.35,87.63 135.81,85.17 K2.4
N$44  (via drill 0.6)
  Top 0.406: IC2.4 116.2,50.16 v115.57,50.8 | K2.3 134.16,88.9 127,88.9 124.46,86.36 v124.46,69.85
  Bottom 0.406: v115.57,50.8 115.57,54.61 124.46,63.5 v124.46,69.85
N$45  (via drill 0.6)
  Top 0.406: IC1.4 90.81,50.16 v90.17,50.8 | K1.3 140.51,87.17 139.7,86.36 139.7,82.55 135.89,78.74 v128.27,78.74
  Bottom 0.406: v90.17,50.8 102.87,50.8 115.57,63.5 115.57,67.31 127,78.74 v128.27,78.74
N$46  (via drill 0.6)
  Top 0.406: K1.4 142.32,85.17 140.97,83.82 140.97,82.55 138.43,80.01 v138.43,78.74 | IC1.9 97.16,48.9 97.79,49.53 v102.87,49.53
  Bottom 0.406: v138.43,78.74 130.81,78.74 129.54,77.47 127,77.47 116.84,67.31 116.84,63.5 v102.87,49.53
N$47  (via drill 0.6)
  Top 0.406: IC1.16 97.16,64.14 v97.79,64.77 | K1.2 143.51,88.9 142.24,88.9 140.97,90.17 139.7,90.17 138.43,88.9 138.43,82.55 135.89,80.01 v129.54,80.01
  Bottom 0.406: v97.79,64.77 97.79,69.85 100.33,72.39 116.84,72.39 118.11,73.66 120.65,73.66 127,80.01 v129.54,80.01
N$48  (via drill 0.6)
  Top 0.406: IC1.21 90.81,61.59 91.44,62.23 v92.71,62.23 | K1.1 139.43,91.17 137.16,88.9 137.16,82.55 135.89,81.28 v128.27,81.28
  Bottom 0.406: v92.71,62.23 92.71,68.58 97.79,73.66 116.84,73.66 118.11,74.93 120.65,74.93 127,81.28 v128.27,81.28
N$49  (via drill 0.61)
  Top 0.254: v148.59,78.74 158.75,78.74 158.75,93.98 154.94,97.79 | U$1.PB_7-PWM4/2 5.08,33.02
  Top 0.305: 154.94,97.79 93.98,97.79 45.72,49.53 6.35,49.53 5.08,48.26 5.08,33.02
  Bottom 0.254: 142.24,57.15 142.24,78.74 v148.59,78.74
  Bottom 0.305: 142.24,57.15 137.43,52.34 FILTER_INDEX.1
OUT1A  (via drill 0.6)
  Top 0.406: K2.2 134.89,90.17 127,90.17 123.19,86.36 v123.19,71.12 | IC2.16 122.56,64.14 v123.19,64.77
  Bottom 0.406: v123.19,64.77 v123.19,71.12
OUT1B  (via drill 0.6)
  Top 0.406: IC2.21 116.2,60.33 116.84,60.96 v118.11,60.96 | K2.1 135.89,91.44 127,91.44 121.92,86.36 121.92,73.66 120.65,72.39 v120.65,68.58
  Bottom 0.406: v118.11,60.96 120.65,63.5 v120.65,68.58
PFD
  Top 0.406: IC1.24 87,59.05 86.36,59.69 R17.2 83.82,64.12 R12.1
RESET
  Top 0.406: IC1.22 89.53,62.22 R15.1
SLEEP
  Top 0.406: IC1.3 89.53,44.47 R11.1
STEP1  (via drill 0.6)
  Top 0.406: IC1.10 98.42,40.01 v97.79,39.37 | U$1.PC_15 8.89,24.13 48.26,24.13 v49.53,25.4
  Bottom 0.305: 50.8,27.94 67.31,27.94 68.58,29.21 81.28,29.21 82.55,27.94 87.63,27.94
  Bottom 0.406: v49.53,25.4 49.53,26.67 50.8,27.94 | 87.63,27.94 97.79,38.1 v97.79,39.37
STEP2  (via drill 0.6)
  Top 0.406: IC2.10 123.83,40.01 v123.19,39.37 | U$1.PH_1 8.89,19.05 48.26,19.05 v49.53,20.32
  Bottom 0.305: 50.8,22.86 67.31,22.86 68.58,24.13 81.28,24.13 82.55,22.86 107.95,22.86
  Bottom 0.406: v123.19,39.37 123.19,38.1 107.95,22.86 | v49.53,20.32 49.53,21.59 50.8,22.86
V+  (via drill 0.6)
  Top 0.406: IC1.5 IC1.20 92.08,59.05 v92.71,59.69 | IC2.5 IC2.20 117.47,55.24 115.57,53.34 109.22,53.34 v105.41,57.15
  Bottom 0.406: v92.71,59.69 102.87,59.69 v105.41,57.15
VCC  (via drill 0.6, 0.61)
  Top 0.254: v99.06,54.61 104.14,49.53 104.14,40.64 101.6,38.1
  Top 0.406: R16.1 98.21,34.71 101.6,38.1 R14.2 | R15.2 90.79,65.42 v90.17,66.04 | R12.2 81.9,64.12 v83.82,66.04
  Bottom 0.254: v90.17,66.04 90.17,54.61 v99.06,54.61
  Bottom 0.406: v83.82,66.04 v90.17,66.04
(copper drawn outside any net)
  shapes: Bottom area x7, Top area x9

### Text on the board
Top: meridianScientific | DIY 3dPrintable_raspberryPi_ramanSpectrometer | controlBoard_01_REV-01